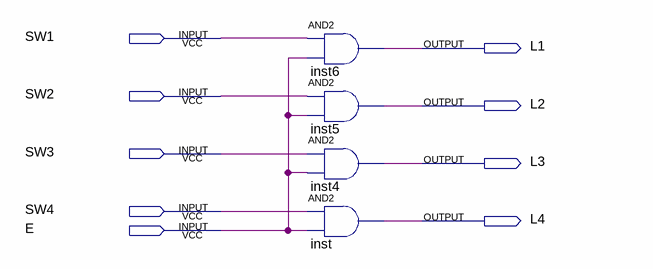
[diagram p0: schematic sheet]
// Quartus schematic 1to1.bdf as structural Verilog: 4 symbols, 9 pins
module \1to1  (
  input  SW1,
  input  SW2,
  input  SW3,
  input  SW4,
  input  E,
  output L1,
  output L2,
  output L3,
  output L4
);

  and inst6 (L1, SW1, E);
  and inst5 (L2, SW2, E);
  and inst4 (L3, SW3, E);
  and inst (L4, SW4, E);
endmodule
